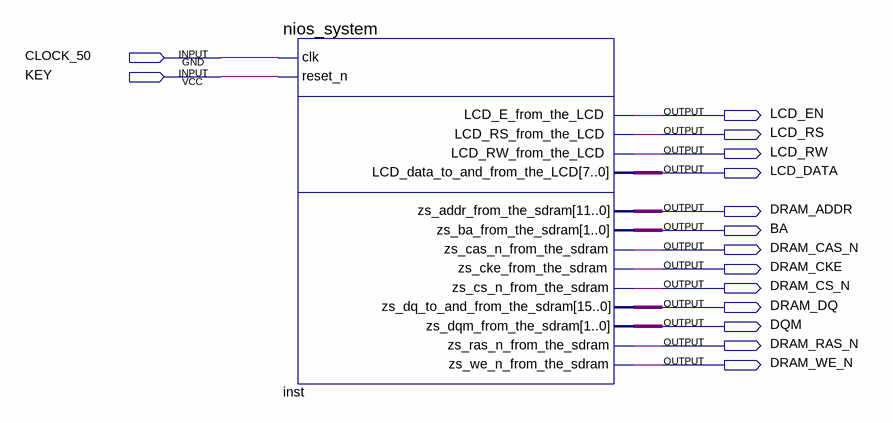
[diagram p0: schematic sheet]
// Quartus schematic Calculator.bdf as structural Verilog: 1 symbols, 15 pins
module Calculator (
  input  CLOCK_50,
  input  KEY,
  output LCD_EN,
  output LCD_RS,
  output LCD_RW,
  output LCD_DATA,
  output DRAM_ADDR,
  output BA,
  output DRAM_CAS_N,
  output DRAM_CKE,
  output DRAM_CS_N,
  output DRAM_DQ,
  output DQM,
  output DRAM_RAS_N,
  output DRAM_WE_N
);

  wire [1:0] inst_zs_ba_from_the_sdram, inst_zs_dqm_from_the_sdram;
  wire [7:0] inst_lcd_data_to_and_from_the_lcd;
  wire [11:0] inst_zs_addr_from_the_sdram;
  wire [15:0] inst_zs_dq_to_and_from_the_sdram;

  nios_system inst (
    .clk(CLOCK_50), .reset_n(KEY), .LCD_E_from_the_LCD(LCD_EN), .LCD_RS_from_the_LCD(LCD_RS),
    .LCD_RW_from_the_LCD(LCD_RW), .zs_addr_from_the_sdram(inst_zs_addr_from_the_sdram),
    .zs_ba_from_the_sdram(inst_zs_ba_from_the_sdram), .zs_cas_n_from_the_sdram(DRAM_CAS_N),
    .zs_cke_from_the_sdram(DRAM_CKE), .zs_cs_n_from_the_sdram(DRAM_CS_N),
    .zs_dqm_from_the_sdram(inst_zs_dqm_from_the_sdram), .zs_ras_n_from_the_sdram(DRAM_RAS_N),
    .zs_we_n_from_the_sdram(DRAM_WE_N), .LCD_data_to_and_from_the_LCD(inst_lcd_data_to_and_from_the_lcd),
    .zs_dq_to_and_from_the_sdram(inst_zs_dq_to_and_from_the_sdram));
endmodule
